# Altium project ANAlOG_MEZZANINE.PrjPcb
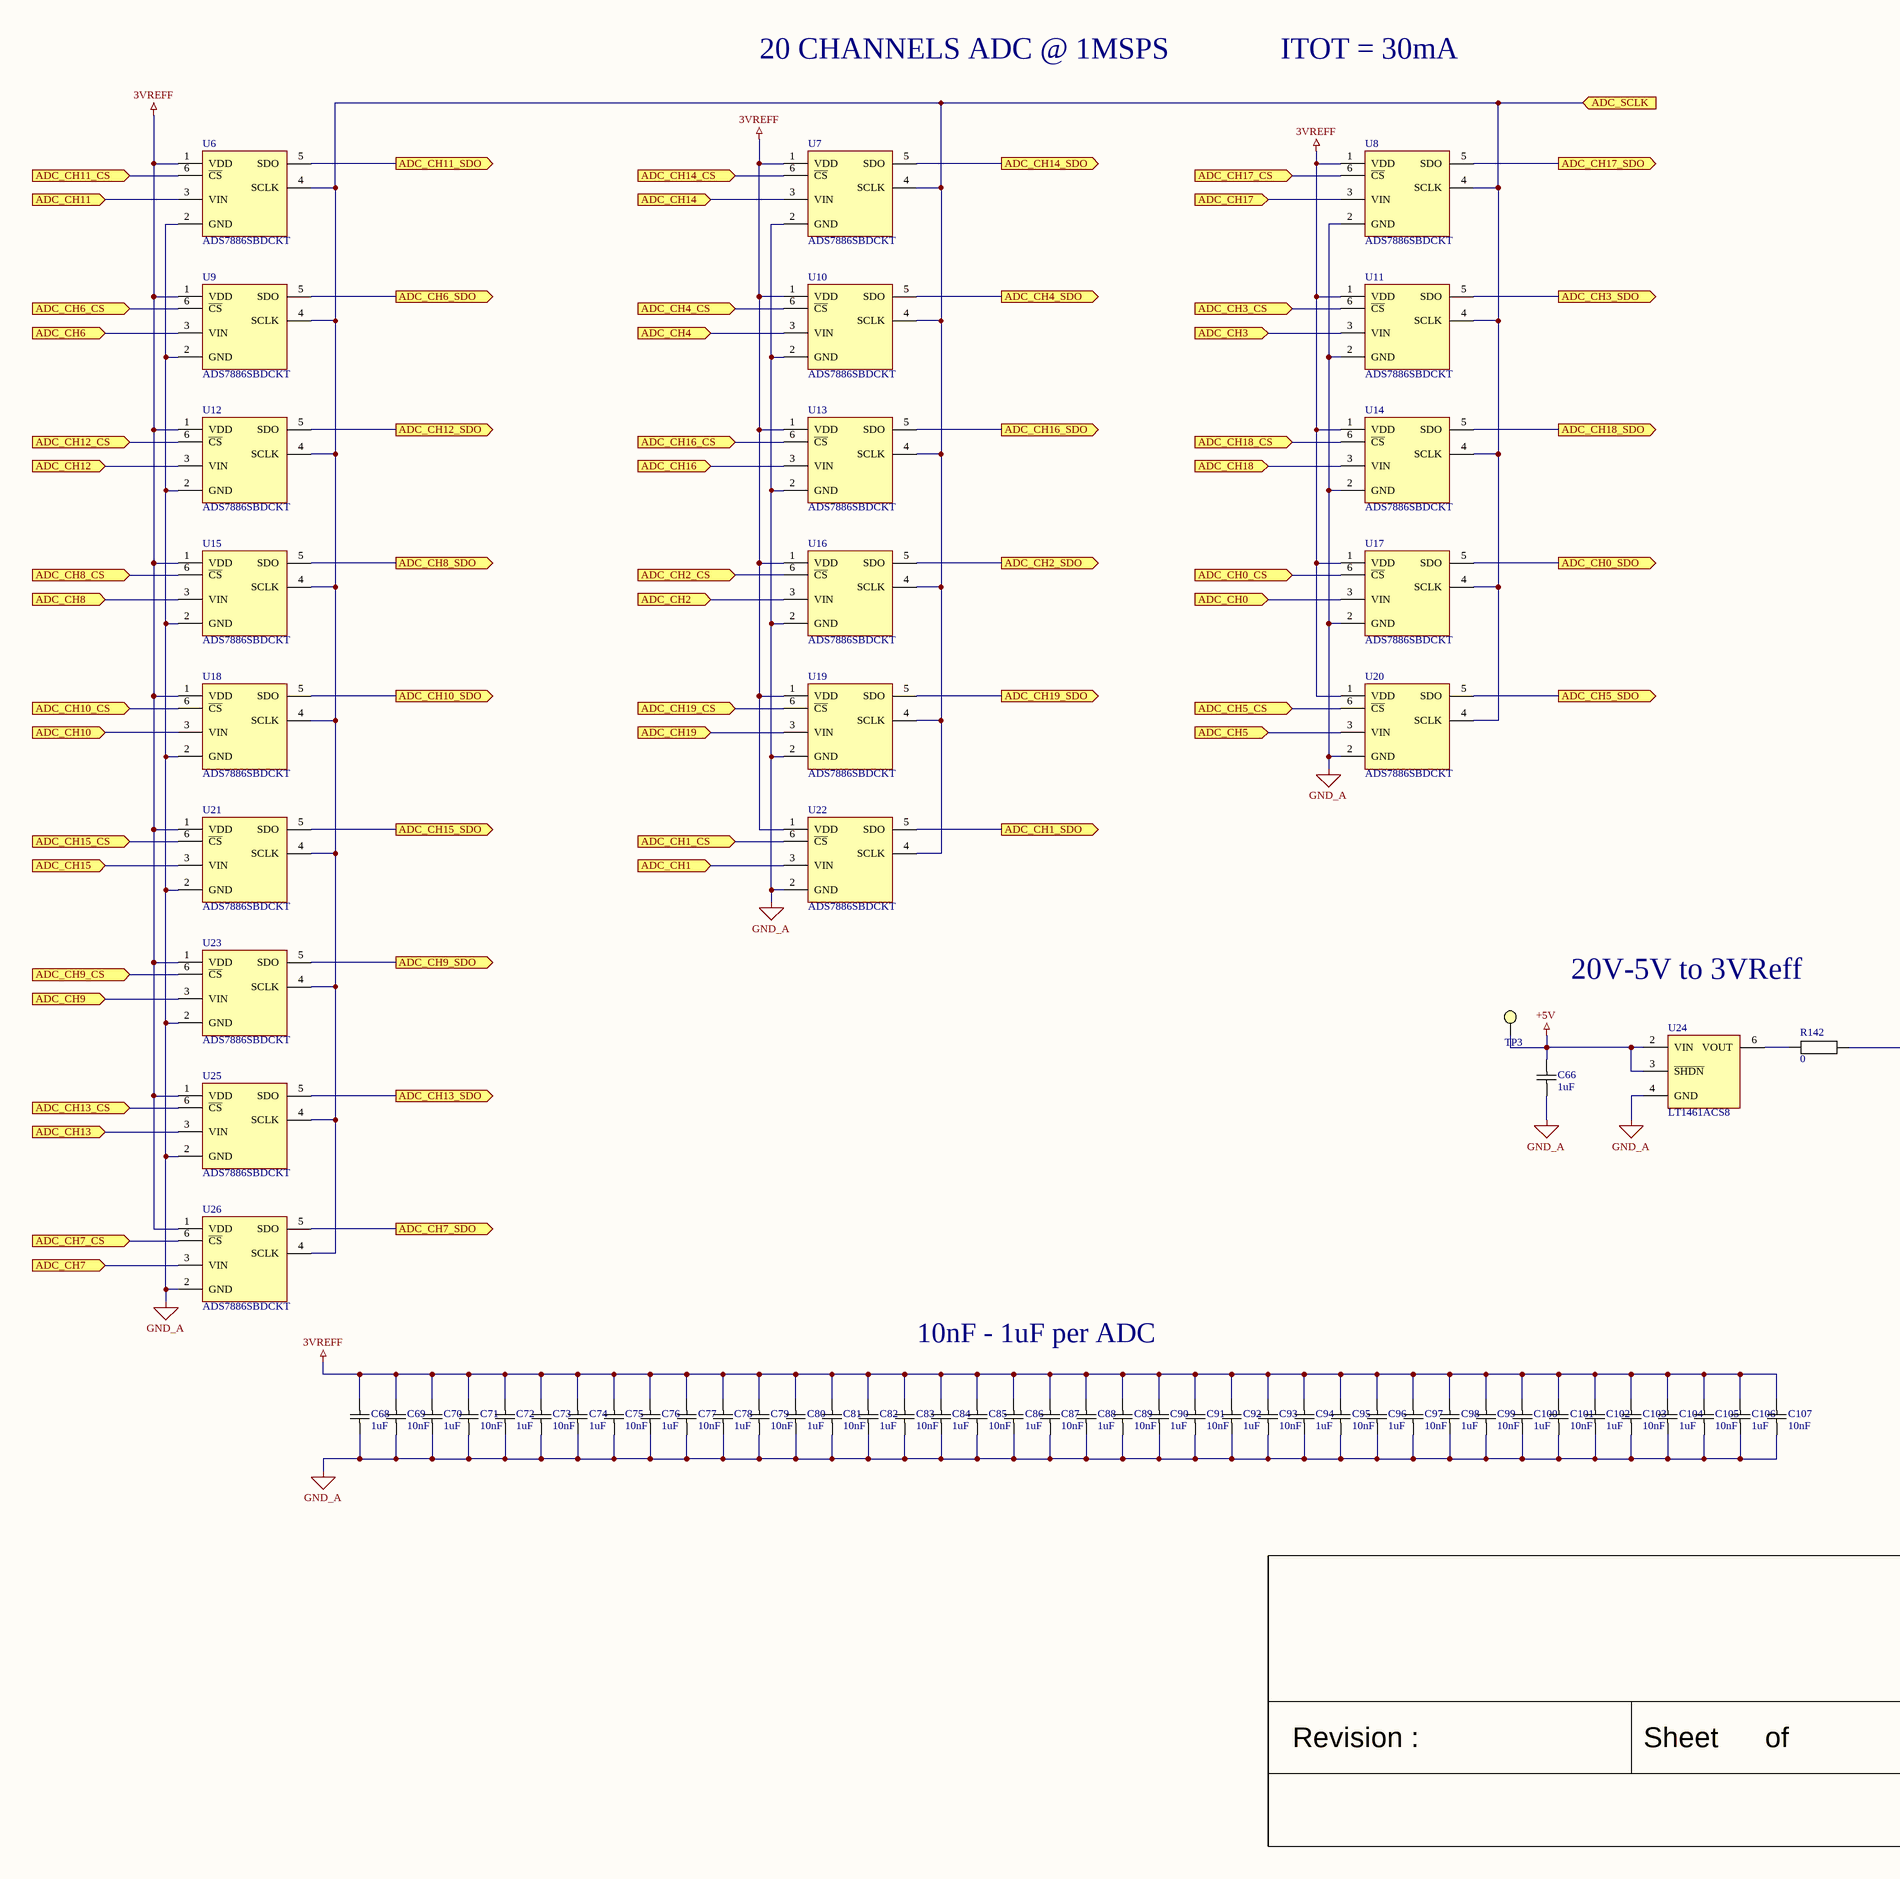
[diagram p0: AD_3.SchDoc, left]
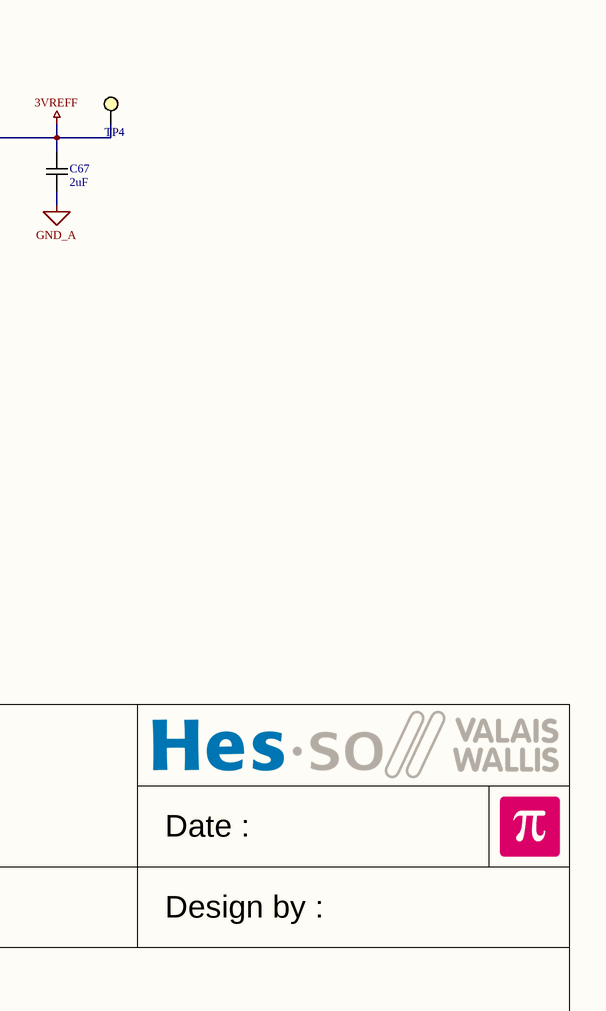
[diagram p1: AD_3.SchDoc, right]
SchDate: 09.06.2021; SchematicDate: 09.06.2021; SchematicDesigner: Jean Nanchen; SchematicRevision: 1.0
3 sheets, 144 parts. Net scope: flat (ports and power ports of the same name join across sheets).
Board file: ANALOG_Mezzanine.PcbDoc
Sheets:
  AD_3.SchDoc
  Supply_0.SchDoc
  DAC_0.SchDoc

## Sheet AD_3.SchDoc
size A2; Date: Date; CompanyName: HESSO; Engineer: Name; Address1: Route du Rawyl 47; Address2: 1950 Sion; Address3: Switzerland; DocumentNumber: 3; SheetNumber: 3; SheetTotal: 6; ProjectName: Project Name

### Parts
C66  1uF  [CAPACITOR 1608 REFLOW]
C67  2uF  [CAPACITOR 1608 REFLOW]
C68  1uF  [CAPACITOR 1608 REFLOW]
C69  10nF  [CAPACITOR 1608 REFLOW]
C70  1uF  [CAPACITOR 1608 REFLOW]
C71  10nF  [CAPACITOR 1608 REFLOW]
C72  1uF  [CAPACITOR 1608 REFLOW]
C73  10nF  [CAPACITOR 1608 REFLOW]
C74  1uF  [CAPACITOR 1608 REFLOW]
C75  10nF  [CAPACITOR 1608 REFLOW]
C76  1uF  [CAPACITOR 1608 REFLOW]
C77  10nF  [CAPACITOR 1608 REFLOW]
C78  1uF  [CAPACITOR 1608 REFLOW]
C79  10nF  [CAPACITOR 1608 REFLOW]
C80  1uF  [CAPACITOR 1608 REFLOW]
C81  10nF  [CAPACITOR 1608 REFLOW]
C82  1uF  [CAPACITOR 1608 REFLOW]
C83  10nF  [CAPACITOR 1608 REFLOW]
C84  1uF  [CAPACITOR 1608 REFLOW]
C85  10nF  [CAPACITOR 1608 REFLOW]
C86  1uF  [CAPACITOR 1608 REFLOW]
C87  10nF  [CAPACITOR 1608 REFLOW]
C88  1uF  [CAPACITOR 1608 REFLOW]
C89  10nF  [CAPACITOR 1608 REFLOW]
C90  1uF  [CAPACITOR 1608 REFLOW]
C91  10nF  [CAPACITOR 1608 REFLOW]
C92  1uF  [CAPACITOR 1608 REFLOW]
C93  10nF  [CAPACITOR 1608 REFLOW]
C94  1uF  [CAPACITOR 1608 REFLOW]
C95  10nF  [CAPACITOR 1608 REFLOW]
C96  1uF  [CAPACITOR 1608 REFLOW]
C97  10nF  [CAPACITOR 1608 REFLOW]
C98  1uF  [CAPACITOR 1608 REFLOW]
C99  10nF  [CAPACITOR 1608 REFLOW]
C100  1uF  [CAPACITOR 1608 REFLOW]
C101  10nF  [CAPACITOR 1608 REFLOW]
C102  1uF  [CAPACITOR 1608 REFLOW]
C103  10nF  [CAPACITOR 1608 REFLOW]
C104  1uF  [CAPACITOR 1608 REFLOW]
C105  10nF  [CAPACITOR 1608 REFLOW]
C106  1uF  [CAPACITOR 1608 REFLOW]
C107  10nF  [CAPACITOR 1608 REFLOW]
R142  0  [RESISTOR 1608 REFLOW]
TP3  *  [Test Point Keystone Miniature RED]  (value not drawn)
TP4  *  [Test Point Keystone Miniature RED]  (value not drawn)
U6  ADS7886SBDCKT  [SOT23-6 P0.95 C1.5x3.0 H1.3]
U7  ADS7886SBDCKT  [SOT23-6 P0.95 C1.5x3.0 H1.3]
U8  ADS7886SBDCKT  [SOT23-6 P0.95 C1.5x3.0 H1.3]
U9  ADS7886SBDCKT  [SOT23-6 P0.95 C1.5x3.0 H1.3]
U10  ADS7886SBDCKT  [SOT23-6 P0.95 C1.5x3.0 H1.3]
U11  ADS7886SBDCKT  [SOT23-6 P0.95 C1.5x3.0 H1.3]
U12  ADS7886SBDCKT  [SOT23-6 P0.95 C1.5x3.0 H1.3]
U13  ADS7886SBDCKT  [SOT23-6 P0.95 C1.5x3.0 H1.3]
U14  ADS7886SBDCKT  [SOT23-6 P0.95 C1.5x3.0 H1.3]
U15  ADS7886SBDCKT  [SOT23-6 P0.95 C1.5x3.0 H1.3]
U16  ADS7886SBDCKT  [SOT23-6 P0.95 C1.5x3.0 H1.3]
U17  ADS7886SBDCKT  [SOT23-6 P0.95 C1.5x3.0 H1.3]
U18  ADS7886SBDCKT  [SOT23-6 P0.95 C1.5x3.0 H1.3]
U19  ADS7886SBDCKT  [SOT23-6 P0.95 C1.5x3.0 H1.3]
U20  ADS7886SBDCKT  [SOT23-6 P0.95 C1.5x3.0 H1.3]
U21  ADS7886SBDCKT  [SOT23-6 P0.95 C1.5x3.0 H1.3]
U22  ADS7886SBDCKT  [SOT23-6 P0.95 C1.5x3.0 H1.3]
U23  ADS7886SBDCKT  [SOT23-6 P0.95 C1.5x3.0 H1.3]
U24  LT1461ACS8  [SO8 P1.27 C4.0X5.0 H1.75]
U25  ADS7886SBDCKT  [SOT23-6 P0.95 C1.5x3.0 H1.3]
U26  ADS7886SBDCKT  [SOT23-6 P0.95 C1.5x3.0 H1.3]

### Ports
ADC_CH0 (in), ADC_CH0_CS (in), ADC_CH0_SDO (out), ADC_CH1 (in), ADC_CH1_CS (in), ADC_CH1_SDO (out), ADC_CH2 (in), ADC_CH2_CS (in), ADC_CH2_SDO (out), ADC_CH3 (in), ADC_CH3_CS (in), ADC_CH3_SDO (out), ADC_CH4 (in), ADC_CH4_CS (in), ADC_CH4_SDO (out), ADC_CH5 (in), ADC_CH5_CS (in), ADC_CH5_SDO (out), ADC_CH6 (in), ADC_CH6_CS (in), ADC_CH6_SDO (out), ADC_CH7 (in), ADC_CH7_CS (in), ADC_CH7_SDO (out), ADC_CH8 (in), ADC_CH8_CS (in), ADC_CH8_SDO (out), ADC_CH9 (in), ADC_CH9_CS (in), ADC_CH9_SDO (out), ADC_CH10 (in), ADC_CH10_CS (in), ADC_CH10_SDO (out), ADC_CH11 (in), ADC_CH11_CS (in), ADC_CH11_SDO (out), ADC_CH12 (in), ADC_CH12_CS (in), ADC_CH12_SDO (out), ADC_CH13 (in), ADC_CH13_CS (in), ADC_CH13_SDO (out), ADC_CH14 (in), ADC_CH14_CS (in), ADC_CH14_SDO (out), ADC_CH15 (in), ADC_CH15_CS (in), ADC_CH15_SDO (out), ADC_CH16 (in), ADC_CH16_CS (in), ADC_CH16_SDO (out), ADC_CH17 (in), ADC_CH17_CS (in), ADC_CH17_SDO (out), ADC_CH18 (in), ADC_CH18_CS (in), ADC_CH18_SDO (out), ADC_CH19 (in), ADC_CH19_CS (in), ADC_CH19_SDO (out), ADC_SCLK (in)

### Nets
3VREFF: C67.2 C68.2 C69.2 C70.2 C71.2 C72.2 C73.2 C74.2 C75.2 C76.2 C77.2 C78.2 C79.2 C80.2 C81.2 C82.2 C83.2 C84.2 C85.2 C86.2 C87.2 C88.2 C89.2 C90.2 C91.2 C92.2 C93.2 C94.2 C95.2 C96.2 C97.2 C98.2 C99.2 C100.2 C101.2 C102.2 C103.2 C104.2 C105.2 C106.2 C107.2 R142.2 TP4.1 U6.1(VDD) U7.1(VDD) U8.1(VDD) U9.1(VDD) U10.1(VDD) U11.1(VDD) U12.1(VDD) U13.1(VDD) U14.1(VDD) U15.1(VDD) U16.1(VDD) U17.1(VDD) U18.1(VDD) U19.1(VDD) U20.1(VDD) U21.1(VDD) U22.1(VDD) U23.1(VDD) U25.1(VDD) U26.1(VDD)
+5V: C66.2 TP3.1 U24.2(VIN) U24.3(~{SHDN})
GND_A: C66.1 C67.1 C68.1 C69.1 C70.1 C71.1 C72.1 C73.1 C74.1 C75.1 C76.1 C77.1 C78.1 C79.1 C80.1 C81.1 C82.1 C83.1 C84.1 C85.1 C86.1 C87.1 C88.1 C89.1 C90.1 C91.1 C92.1 C93.1 C94.1 C95.1 C96.1 C97.1 C98.1 C99.1 C100.1 C101.1 C102.1 C103.1 C104.1 C105.1 C106.1 C107.1 U6.2(GND) U7.2(GND) U8.2(GND) U9.2(GND) U10.2(GND) U11.2(GND) U12.2(GND) U13.2(GND) U14.2(GND) U15.2(GND) U16.2(GND) U17.2(GND) U18.2(GND) U19.2(GND) U20.2(GND) U21.2(GND) U22.2(GND) U23.2(GND) U24.4(GND) U25.2(GND) U26.2(GND)
ADC_CH0: U17.3(VIN) ; port ADC_CH0
ADC_CH0_CS: U17.6(~{CS}) ; port ADC_CH0_CS
ADC_CH0_SDO: U17.5(SDO) ; port ADC_CH0_SDO
ADC_CH1: U22.3(VIN) ; port ADC_CH1
ADC_CH1_CS: U22.6(~{CS}) ; port ADC_CH1_CS
ADC_CH1_SDO: U22.5(SDO) ; port ADC_CH1_SDO
ADC_CH2: U16.3(VIN) ; port ADC_CH2
ADC_CH2_CS: U16.6(~{CS}) ; port ADC_CH2_CS
ADC_CH2_SDO: U16.5(SDO) ; port ADC_CH2_SDO
ADC_CH3: U11.3(VIN) ; port ADC_CH3
ADC_CH3_CS: U11.6(~{CS}) ; port ADC_CH3_CS
ADC_CH3_SDO: U11.5(SDO) ; port ADC_CH3_SDO
ADC_CH4: U10.3(VIN) ; port ADC_CH4
ADC_CH4_CS: U10.6(~{CS}) ; port ADC_CH4_CS
ADC_CH4_SDO: U10.5(SDO) ; port ADC_CH4_SDO
ADC_CH5: U20.3(VIN) ; port ADC_CH5
ADC_CH5_CS: U20.6(~{CS}) ; port ADC_CH5_CS
ADC_CH5_SDO: U20.5(SDO) ; port ADC_CH5_SDO
ADC_CH6: U9.3(VIN) ; port ADC_CH6
ADC_CH6_CS: U9.6(~{CS}) ; port ADC_CH6_CS
ADC_CH6_SDO: U9.5(SDO) ; port ADC_CH6_SDO
ADC_CH7: U26.3(VIN) ; port ADC_CH7
ADC_CH7_CS: U26.6(~{CS}) ; port ADC_CH7_CS
ADC_CH7_SDO: U26.5(SDO) ; port ADC_CH7_SDO
ADC_CH8: U15.3(VIN) ; port ADC_CH8
ADC_CH8_CS: U15.6(~{CS}) ; port ADC_CH8_CS
ADC_CH8_SDO: U15.5(SDO) ; port ADC_CH8_SDO
ADC_CH9: U23.3(VIN) ; port ADC_CH9
ADC_CH9_CS: U23.6(~{CS}) ; port ADC_CH9_CS
ADC_CH9_SDO: U23.5(SDO) ; port ADC_CH9_SDO
ADC_CH10: U18.3(VIN) ; port ADC_CH10
ADC_CH10_CS: U18.6(~{CS}) ; port ADC_CH10_CS
ADC_CH10_SDO: U18.5(SDO) ; port ADC_CH10_SDO
ADC_CH11: U6.3(VIN) ; port ADC_CH11
ADC_CH11_CS: U6.6(~{CS}) ; port ADC_CH11_CS
ADC_CH11_SDO: U6.5(SDO) ; port ADC_CH11_SDO
ADC_CH12: U12.3(VIN) ; port ADC_CH12
ADC_CH12_CS: U12.6(~{CS}) ; port ADC_CH12_CS
ADC_CH12_SDO: U12.5(SDO) ; port ADC_CH12_SDO
ADC_CH13: U25.3(VIN) ; port ADC_CH13
ADC_CH13_CS: U25.6(~{CS}) ; port ADC_CH13_CS
ADC_CH13_SDO: U25.5(SDO) ; port ADC_CH13_SDO
ADC_CH14: U7.3(VIN) ; port ADC_CH14
ADC_CH14_CS: U7.6(~{CS}) ; port ADC_CH14_CS
ADC_CH14_SDO: U7.5(SDO) ; port ADC_CH14_SDO
ADC_CH15: U21.3(VIN) ; port ADC_CH15
ADC_CH15_CS: U21.6(~{CS}) ; port ADC_CH15_CS
ADC_CH15_SDO: U21.5(SDO) ; port ADC_CH15_SDO
ADC_CH16: U13.3(VIN) ; port ADC_CH16
ADC_CH16_CS: U13.6(~{CS}) ; port ADC_CH16_CS
ADC_CH16_SDO: U13.5(SDO) ; port ADC_CH16_SDO
ADC_CH17: U8.3(VIN) ; port ADC_CH17
ADC_CH17_CS: U8.6(~{CS}) ; port ADC_CH17_CS
ADC_CH17_SDO: U8.5(SDO) ; port ADC_CH17_SDO
ADC_CH18: U14.3(VIN) ; port ADC_CH18
ADC_CH18_CS: U14.6(~{CS}) ; port ADC_CH18_CS
ADC_CH18_SDO: U14.5(SDO) ; port ADC_CH18_SDO
ADC_CH19: U19.3(VIN) ; port ADC_CH19
ADC_CH19_CS: U19.6(~{CS}) ; port ADC_CH19_CS
ADC_CH19_SDO: U19.5(SDO) ; port ADC_CH19_SDO
ADC_SCLK: U6.4(SCLK) U7.4(SCLK) U8.4(SCLK) U9.4(SCLK) U10.4(SCLK) U11.4(SCLK) U12.4(SCLK) U13.4(SCLK) U14.4(SCLK) U15.4(SCLK) U16.4(SCLK) U17.4(SCLK) U18.4(SCLK) U19.4(SCLK) U20.4(SCLK) U21.4(SCLK) U22.4(SCLK) U23.4(SCLK) U25.4(SCLK) U26.4(SCLK) ; port ADC_SCLK
NetR142_1: R142.1 U24.6(VOUT)

### Notes on the sheet
- 20 CHANNELS ADC @ 1MSPS
- ITOT = 30mA
- 20V-5V to 3VReff
- 10nF - 1uF per ADC
- Date :
- Revision :
- Sheet
- of
- Design by :

### Library data of the parts
C66-C107 = Capacitor
  C66 C68 C70 C72 C74 C76 C78 C80 C82 C84 C86 C88 C90 C92 C94 C96 C98 C100 C102 C104 C106: Value: 1uF
  C67: Value: 2uF
  C69 C71 C73 C75 C77 C79 C81 C83 C85 C87 C89 C91 C93 C95 C97 C99 C101 C103 C105 C107: Value: 10nF
R142 = Resistor: Resistor 1% 50V 100mW 1608(0603); Value: 0
TP3 TP4 = Test Point: Value: *
U6-U23 U25 U26 = ADS7886SBDCKT: 12-Bit, 1-MSPS, Micro-Power, Miniature SAR Analog-to-Digital Converters; Value: ADS7886SBDCKT
U24 = LT1461ACS8: Micropower Precision Low Dropout Series Voltage Reference Family; Value: LT1461ACS8

## Sheet Supply_0.SchDoc
size A2; Date: Date; CompanyName: HESSO; Engineer: Name; Address1: Route du Rawyl 47; Address2: 1950 Sion; Address3: Switzerland; DocumentNumber: 5; SheetNumber: 5; SheetTotal: 6; ProjectName: Project Name
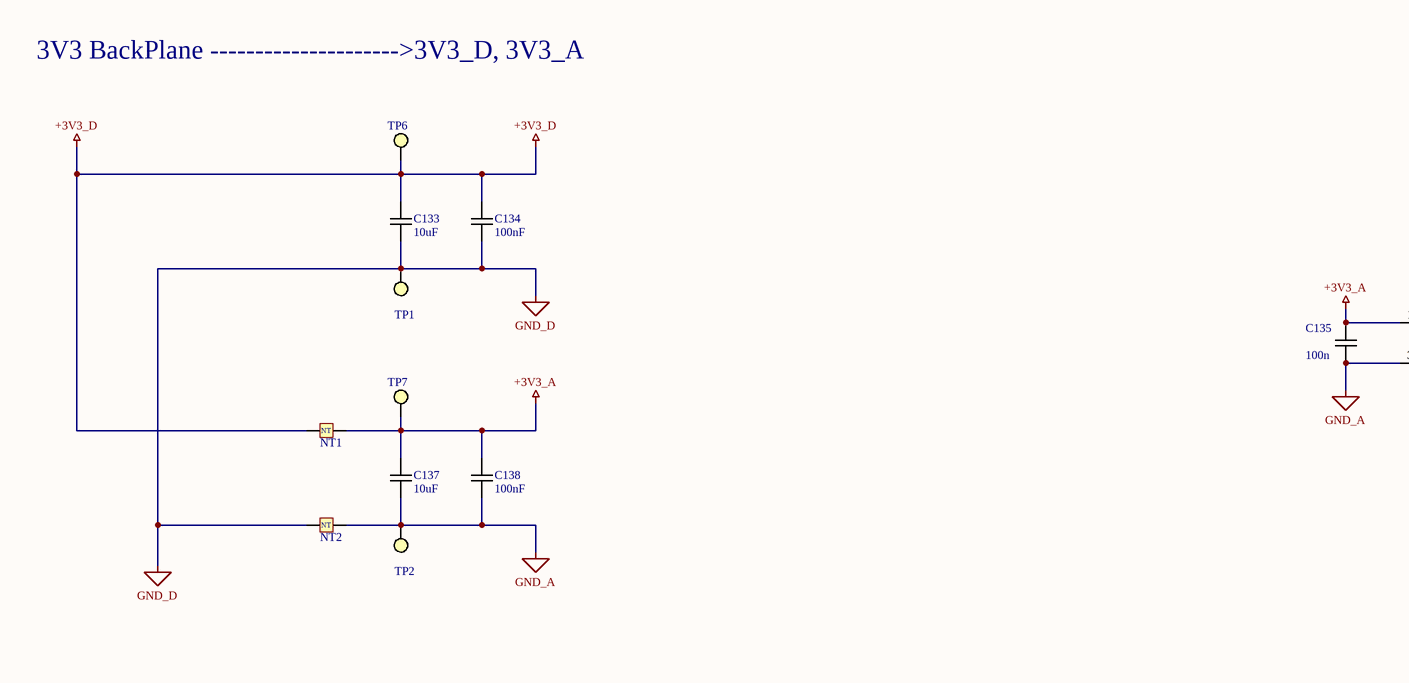
[diagram p2: Supply_0.SchDoc, left]
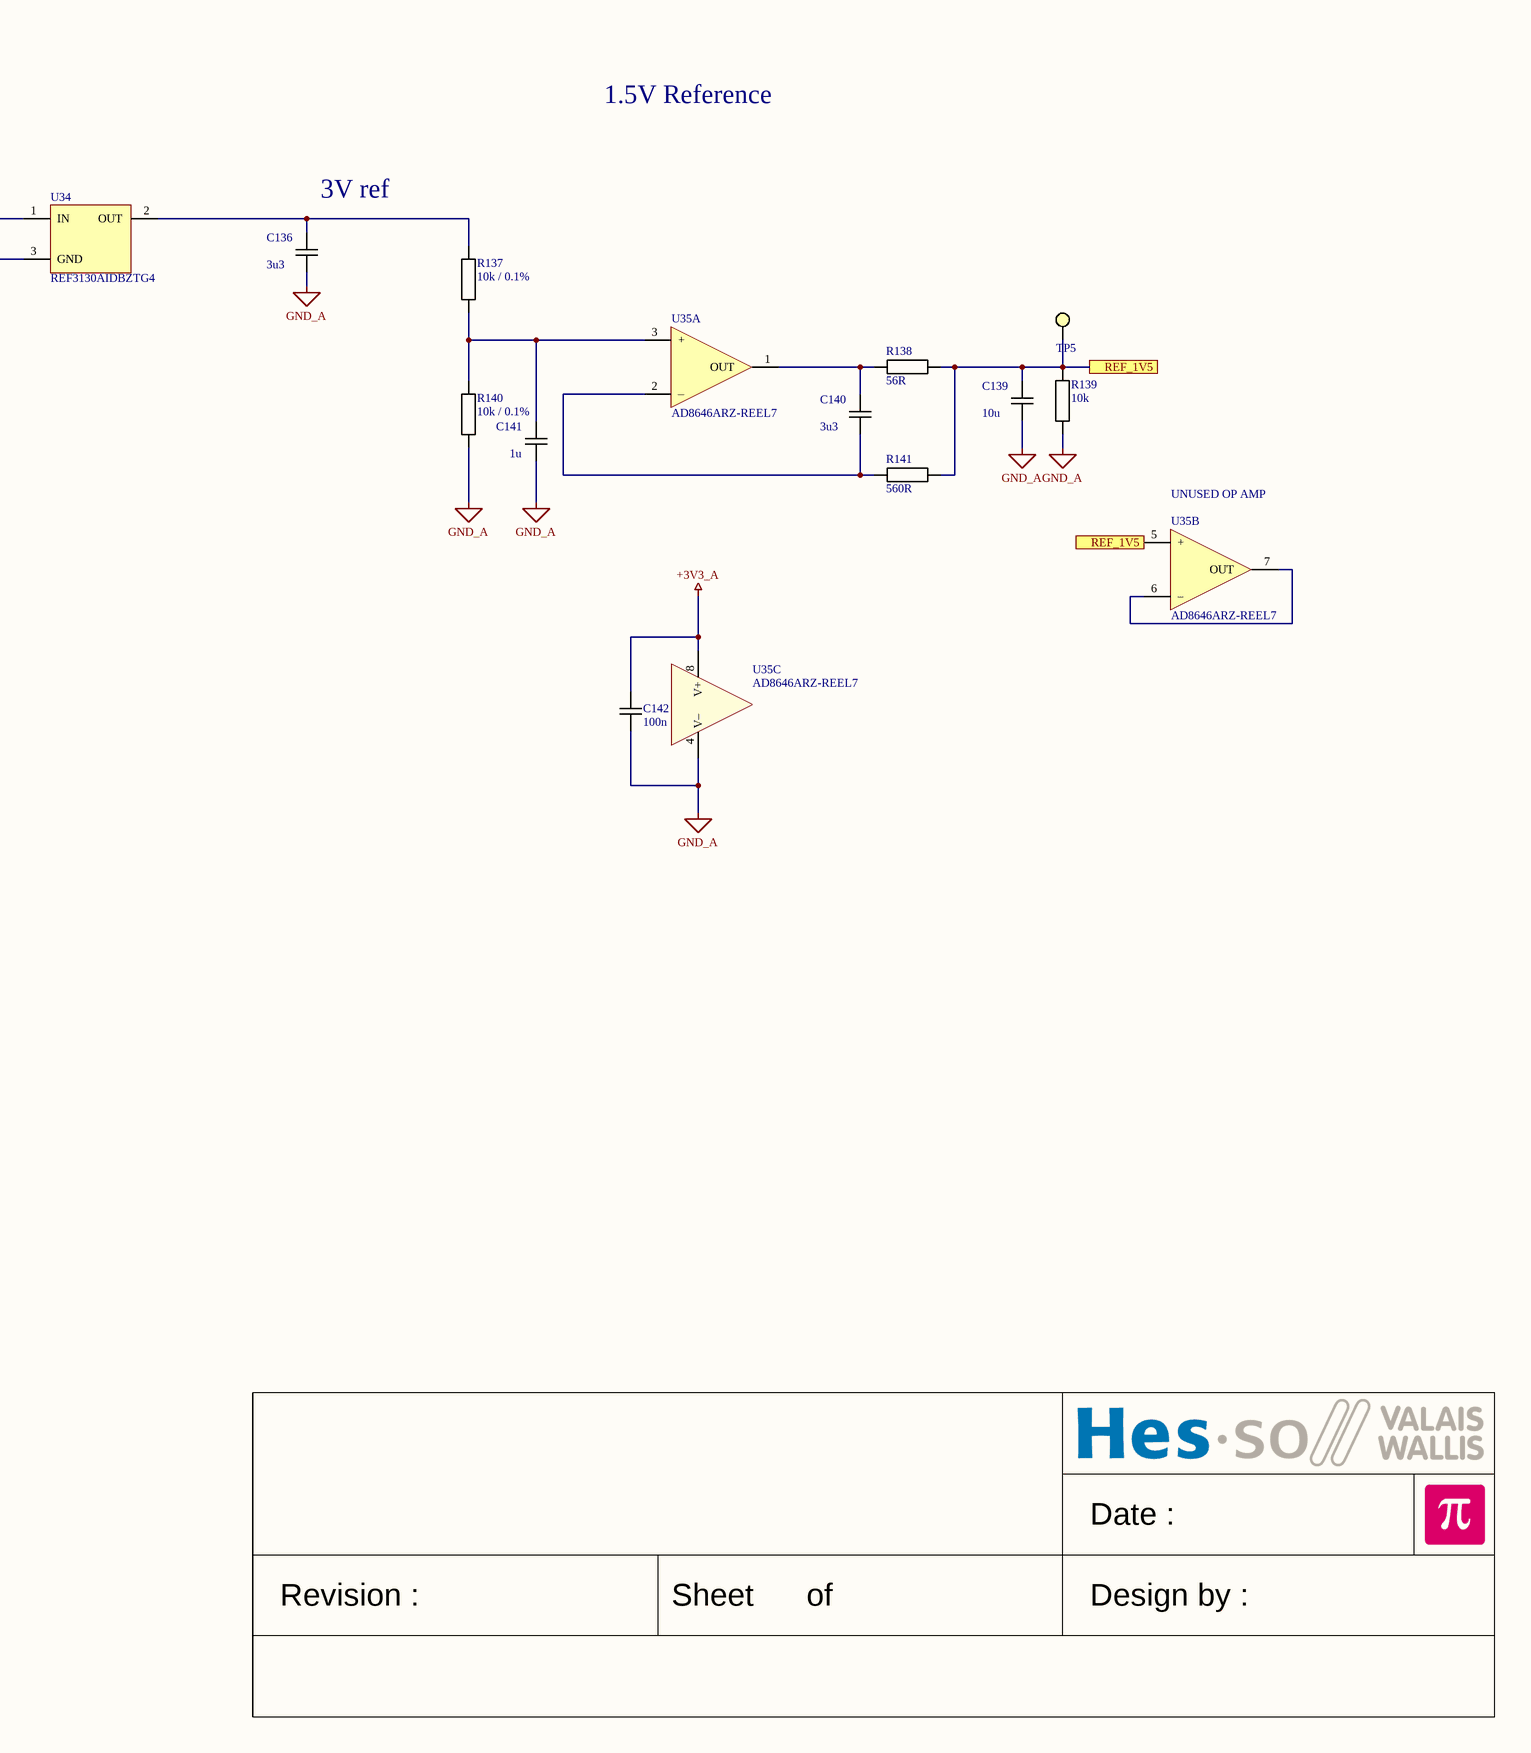
[diagram p3: Supply_0.SchDoc, right]

### Parts
C133  10uF  [CAPACITOR 2012 REFLOW]
C134  100nF  [CAPACITOR 2012 REFLOW]
C135  100n  [CAPACITOR 1608 REFLOW]
C136  3u3  [CAPACITOR 2012 REFLOW]
C137  10uF  [CAPACITOR 2012 REFLOW]
C138  100nF  [CAPACITOR 2012 REFLOW]
C139  10u  [CAPACITOR 2012 REFLOW]
C140  3u3  [CAPACITOR 2012 REFLOW]
C141  1u  [CAPACITOR 2012 REFLOW]
C142  100n  [CAPACITOR 1608 REFLOW]
NT1  Net Tie  [NET TIE 1005]  (value not drawn)  (net tie, no BOM)
NT2  Net Tie  [NET TIE 1005]  (value not drawn)  (net tie, no BOM)
R137  10k / 0.1%  [RESISTOR 1608 REFLOW]
R138  56R  [RESISTOR 1608 REFLOW]
R139  10k  [RESISTOR 1608 REFLOW]
R140  10k / 0.1%  [RESISTOR 1608 REFLOW]
R141  560R  [RESISTOR 1608 REFLOW]
TP1  *  [Test Point Keystone Miniature BLACK]  (value not drawn)
TP2  *  [Test Point Keystone Miniature BLACK]  (value not drawn)
TP5  *  [Test Point Keystone Miniature RED]  (value not drawn)
TP6  *  [Test Point Keystone Miniature BLACK]  (value not drawn)
TP7  *  [Test Point Keystone Miniature BLACK]  (value not drawn)
U34  REF3130AIDBZTG4  [SOT23 P0.95 C1.6x3.0 H1.3]
U35  AD8646ARZ-REEL7  [SO8 P1.27 C4.0X5.0 H1.75]  (parts A,B,C of 3)

### Ports
REF_1V5

### Nets
+3V3_A: C135.2 C137.1 C138.1 C142.2 NT1.2 TP7.1 U34.1(IN) U35.8(V+)
+3V3_D: C133.1 C134.1 NT1.1 TP6.1
GND_A: C135.1 C136.1 C137.2 C138.2 C139.1 C141.1 C142.1 NT2.2 R139.2 R140.2 TP2.1 U34.3(GND) U35.4(V–)
GND_D: C133.2 C134.2 NT2.1 TP1.1
REF_1V5: C139.2 R138.1 R139.1 R141.1 TP5.1 U35.5(+) ; port REF_1V5
NetC136_2: C136.2 R137.2 U34.2(OUT)
NetC140_1: C140.1 R141.2 U35.2(–)
NetC140_2: C140.2 R138.2 U35.1(OUT)
NetC141_2: C141.2 R137.1 R140.1 U35.3(+)
NetU35_6: U35.6(–) U35.7(OUT)

### Notes on the sheet
- 3V3 BackPlane --------------------->3V3_D, 3V3_A
- 1.5V Reference
- (near C136) 3V ref
- (near U35) UNUSED OP AMP
- Date :
- Revision :
- Sheet
- of
- Design by :
- (in symbol Net Tie) NT

### Library data of the parts
C133 C136 C137 C139-C141 = Capacitor: Capacitor X7R 10% 10V 2012(0805)
  C133 C137: Value: 10uF
  C136 C140: Value: 3u3
  C139: Value: 10u
  C141: Value: 1u
C134 C138 = Capacitor: Capacitor X7R 10% 50V 2012(0805); Value: 100nF
C135 C142 = Capacitor: Capacitor X7R 10% 50V 1608(0603); Value: 100n
NT1 NT2 = Net Tie: Connection for 2 different NETNAME
R137-R141 = Resistor: Resistor 1% 50V 100mW 1608(0603)
  R137 R140: Value: 10k / 0.1%
  R138: Value: 56R
  R139: Value: 10k
  R141: Value: 560R
TP1 TP2 TP5-TP7 = Test Point: Value: *
U34 = REFERENCE SOT23 IN,OUT,GND: Generic Positive Voltage Reference; Value: REF3130AIDBZTG4
U35 = OPA DUAL: Generic dual OPA 8 pins; Manufacturer: Analog Devices; Value: AD8646ARZ-REEL7; Mouser No.: 584-AD8646ARZ-R7

## Sheet DAC_0.SchDoc
size A2; Date: Date; CompanyName: HESSO; Engineer: Name; Address1: Route du Rawyl 47; Address2: 1950 Sion; Address3: Switzerland; DocumentNumber: 6; SheetNumber: 6; SheetTotal: 6; ProjectName: Project Name
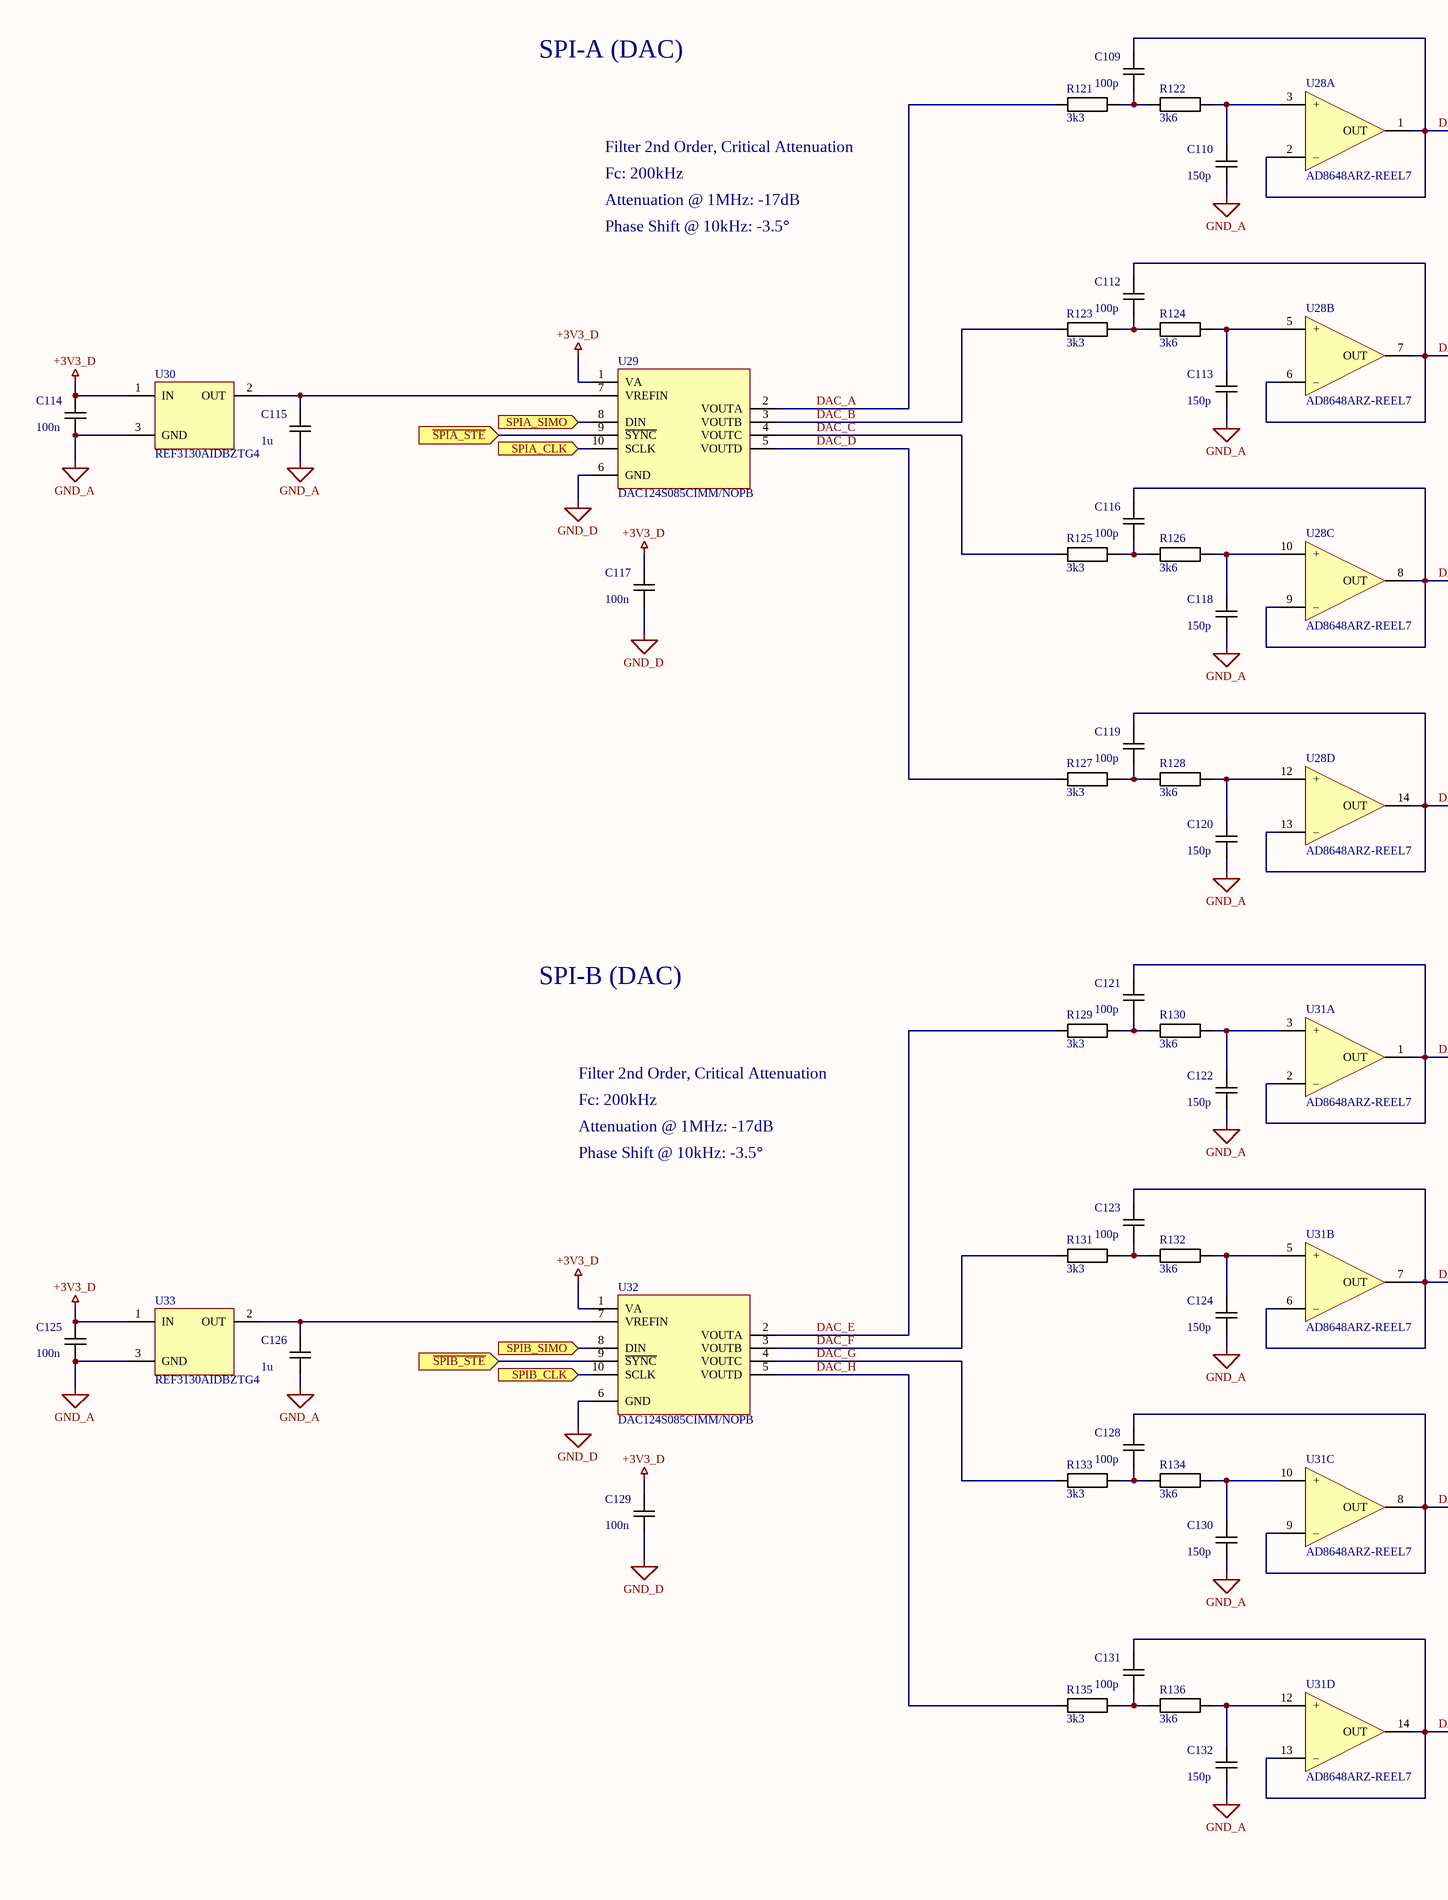
[diagram p4: DAC_0.SchDoc, left]
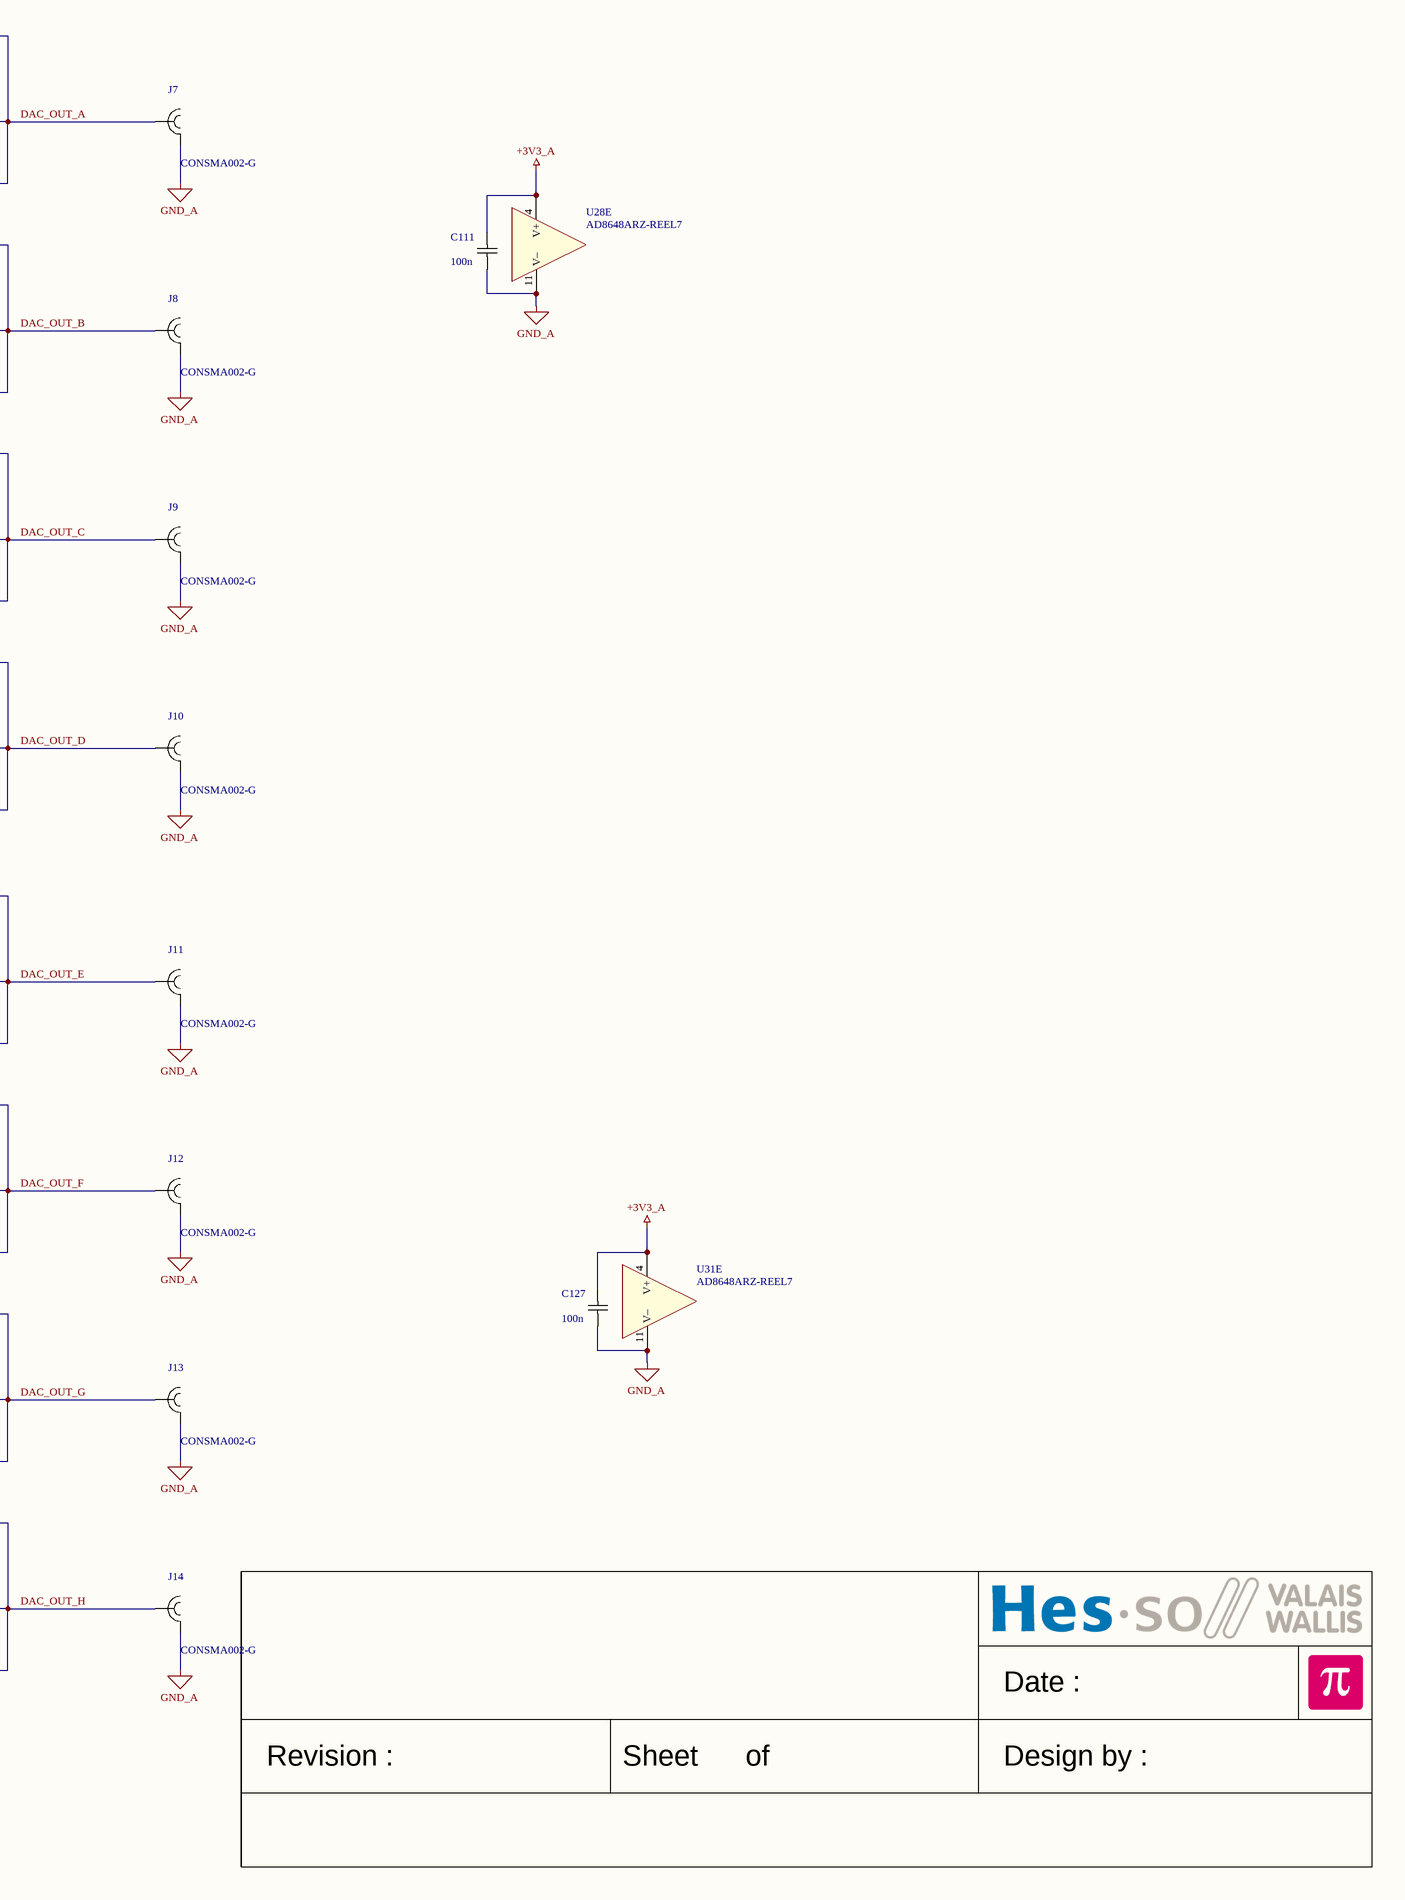
[diagram p5: DAC_0.SchDoc, right]

### Parts
C109  100p  [CAPACITOR 2012 REFLOW]
C110  150p  [CAPACITOR 2012 REFLOW]
C111  100n  [CAPACITOR 1608 REFLOW]
C112  100p  [CAPACITOR 2012 REFLOW]
C113  150p  [CAPACITOR 2012 REFLOW]
C114  100n  [CAPACITOR 2012 REFLOW]
C115  1u  [CAPACITOR 2012 REFLOW]
C116  100p  [CAPACITOR 2012 REFLOW]
C117  100n  [CAPACITOR 1608 REFLOW]
C118  150p  [CAPACITOR 2012 REFLOW]
C119  100p  [CAPACITOR 2012 REFLOW]
C120  150p  [CAPACITOR 2012 REFLOW]
C121  100p  [CAPACITOR 2012 REFLOW]
C122  150p  [CAPACITOR 2012 REFLOW]
C123  100p  [CAPACITOR 2012 REFLOW]
C124  150p  [CAPACITOR 2012 REFLOW]
C125  100n  [CAPACITOR 2012 REFLOW]
C126  1u  [CAPACITOR 2012 REFLOW]
C127  100n  [CAPACITOR 1608 REFLOW]
C128  100p  [CAPACITOR 2012 REFLOW]
C129  100n  [CAPACITOR 1608 REFLOW]
C130  150p  [CAPACITOR 2012 REFLOW]
C131  100p  [CAPACITOR 2012 REFLOW]
C132  150p  [CAPACITOR 2012 REFLOW]
J7  CONSMA002-G  [SMA TH Right Angle Linx CONSMA002]
J8  CONSMA002-G  [SMA TH Right Angle Linx CONSMA002]
J9  CONSMA002-G  [SMA TH Right Angle Linx CONSMA002]
J10  CONSMA002-G  [SMA TH Right Angle Linx CONSMA002]
J11  CONSMA002-G  [SMA TH Right Angle Linx CONSMA002]
J12  CONSMA002-G  [SMA TH Right Angle Linx CONSMA002]
J13  CONSMA002-G  [SMA TH Right Angle Linx CONSMA002]
J14  CONSMA002-G  [SMA TH Right Angle Linx CONSMA002]
R121  3k3  [RESISTOR 2012 REFLOW]
R122  3k6  [RESISTOR 2012 REFLOW]
R123  3k3  [RESISTOR 2012 REFLOW]
R124  3k6  [RESISTOR 2012 REFLOW]
R125  3k3  [RESISTOR 2012 REFLOW]
R126  3k6  [RESISTOR 2012 REFLOW]
R127  3k3  [RESISTOR 2012 REFLOW]
R128  3k6  [RESISTOR 2012 REFLOW]
R129  3k3  [RESISTOR 2012 REFLOW]
R130  3k6  [RESISTOR 2012 REFLOW]
R131  3k3  [RESISTOR 2012 REFLOW]
R132  3k6  [RESISTOR 2012 REFLOW]
R133  3k3  [RESISTOR 2012 REFLOW]
R134  3k6  [RESISTOR 2012 REFLOW]
R135  3k3  [RESISTOR 2012 REFLOW]
R136  3k6  [RESISTOR 2012 REFLOW]
U28  AD8648ARZ-REEL7  [SO14 P1.27 C4.0X8.8 H1.75]  (parts A,B,C,D,E of 5)
U29  DAC124S085CIMM/NOPB  [VSSOP10 P0.5 C3.1X3.1 H1.1]
U30  REF3130AIDBZTG4  [SOT23 P0.95 C1.6x3.0 H1.3]
U31  AD8648ARZ-REEL7  [SO14 P1.27 C4.0X8.8 H1.75]  (parts A,B,C,D,E of 5)
U32  DAC124S085CIMM/NOPB  [VSSOP10 P0.5 C3.1X3.1 H1.1]
U33  REF3130AIDBZTG4  [SOT23 P0.95 C1.6x3.0 H1.3]

### Ports
SPIA_CLK (in), SPIA_SIMO (in), SPIB_CLK (in), SPIB_SIMO (in), ~{SPIA_STE} (in), ~{SPIB_STE} (in)

### Nets
+3V3_A: C111.2 C127.2 U28.4(V+) U31.4(V+)
+3V3_D: C114.2 C117.2 C125.2 C129.2 U29.1(VA) U30.1(IN) U32.1(VA) U33.1(IN)
GND_A: C110.1 C111.1 C113.1 C114.1 C115.1 C118.1 C120.1 C122.1 C124.1 C125.1 C126.1 C127.1 C130.1 C132.1 J7.2 J8.2 J9.2 J10.2 J11.2 J12.2 J13.2 J14.2 U28.11(V–) U30.3(GND) U31.11(V–) U33.3(GND)
GND_D: C117.1 C129.1 U29.6(GND) U32.6(GND)
~{SPIA_STE}: U29.9(~{SYNC}) ; port ~{SPIA_STE}
~{SPIB_STE}: U32.9(~{SYNC}) ; port ~{SPIB_STE}
DAC_A: R121.1 U29.2(VOUTA)
DAC_B: R123.1 U29.3(VOUTB)
DAC_C: R125.1 U29.4(VOUTC)
DAC_D: R127.1 U29.5(VOUTD)
DAC_E: R129.1 U32.2(VOUTA)
DAC_F: R131.1 U32.3(VOUTB)
DAC_G: R133.1 U32.4(VOUTC)
DAC_H: R135.1 U32.5(VOUTD)
DAC_OUT_A: C109.2 J7.1 U28.1(OUT) U28.2(–)
DAC_OUT_B: C112.2 J8.1 U28.6(–) U28.7(OUT)
DAC_OUT_C: C116.2 J9.1 U28.8(OUT) U28.9(–)
DAC_OUT_D: C119.2 J10.1 U28.13(–) U28.14(OUT)
DAC_OUT_E: C121.2 J11.1 U31.1(OUT) U31.2(–)
DAC_OUT_F: C123.2 J12.1 U31.6(–) U31.7(OUT)
DAC_OUT_G: C128.2 J13.1 U31.8(OUT) U31.9(–)
DAC_OUT_H: C131.2 J14.1 U31.13(–) U31.14(OUT)
SPIA_CLK: U29.10(SCLK) ; port SPIA_CLK
SPIA_SIMO: U29.8(DIN) ; port SPIA_SIMO
SPIB_CLK: U32.10(SCLK) ; port SPIB_CLK
SPIB_SIMO: U32.8(DIN) ; port SPIB_SIMO
NetC109_1: C109.1 R121.2 R122.1
NetC110_2: C110.2 R122.2 U28.3(+)
NetC112_1: C112.1 R123.2 R124.1
NetC113_2: C113.2 R124.2 U28.5(+)
NetC115_2: C115.2 U29.7(VREFIN) U30.2(OUT)
NetC116_1: C116.1 R125.2 R126.1
NetC118_2: C118.2 R126.2 U28.10(+)
NetC119_1: C119.1 R127.2 R128.1
NetC120_2: C120.2 R128.2 U28.12(+)
NetC121_1: C121.1 R129.2 R130.1
NetC122_2: C122.2 R130.2 U31.3(+)
NetC123_1: C123.1 R131.2 R132.1
NetC124_2: C124.2 R132.2 U31.5(+)
NetC126_2: C126.2 U32.7(VREFIN) U33.2(OUT)
NetC128_1: C128.1 R133.2 R134.1
NetC130_2: C130.2 R134.2 U31.10(+)
NetC131_1: C131.1 R135.2 R136.1
NetC132_2: C132.2 R136.2 U31.12(+)

### Notes on the sheet
- SPI-A (DAC)
- Filter 2nd Order, Critical Attenuation
- Fc: 200kHz
- Attenuation @ 1MHz: -17dB
- Phase Shift @ 10kHz: -3.5°
- SPI-B (DAC)
- Date :
- Revision :
- Sheet
- of
- Design by :

### Library data of the parts
C109 C110 C112-C114 C116 C118-C125 C128 C130-C132 = Capacitor: Capacitor X7R 10% 50V 2012(0805)
  C109 C112 C116 C119 C121 C123 C128 C131: Value: 100p
  C110 C113 C118 C120 C122 C124 C130 C132: Value: 150p
  C114 C125: Value: 100n
C111 C117 C127 C129 = Capacitor: Capacitor X7R 10% 50V 1608(0603); Value: 100n
C115 C126 = Capacitor: Capacitor X7R 10% 10V 2012(0805); Value: 1u
J7-J14 = SMA TH RIGHT ANGLE LINX CONSMA002: Manufacturer: Linx Technologies; Value: CONSMA002-G; Mouser No.: 712-CONSMA002-G
R121-R136 = Resistor: Resistor 1% 50V 125mW 2012(0805)
  R121 R123 R125 R127 R129 R131 R133 R135: Value: 3k3
  R122 R124 R126 R128 R130 R132 R134 R136: Value: 3k6
U28 U31 = OPA QUAD: Generic quad OPA 14 pins; Manufacturer: Analog Devices; Value: AD8648ARZ-REEL7; Mouser No.: 584-AD8648ARZ-R7
U29 U32 = DAC124S085CIMM: DAC124S085 12-Bit Micro Power Quad Digital-to-Analog Converter With Rail-to-Rail Output; Manufacturer: Texas Instruments; Value: DAC124S085CIMM/NOPB; Mouser No.: 926-DAC124S085CIMMNO
U30 U33 = REFERENCE SOT23 IN,OUT,GND: Generic Positive Voltage Reference; Value: REF3130AIDBZTG4

## Nets that join several sheets
+3V3_A: Supply_0 (8 pins), DAC_0 (C111.2 C127.2 U28.4 U31.4)
+3V3_D: Supply_0 (C133.1 C134.1 NT1.1 TP6.1), DAC_0 (8 pins)
GND_A: AD_3 (63 pins), Supply_0 (13 pins), DAC_0 (26 pins)
GND_D: Supply_0 (C133.2 C134.2 NT2.1 TP1.1), DAC_0 (C117.1 C129.1 U29.6 U32.6)